# Altium schematic sheet MCU.SchDoc: MCU
size A4; DrawnBy: Nilesh Amarathunge; Revision: V1.0; SheetNumber: 1; SheetTotal: 4
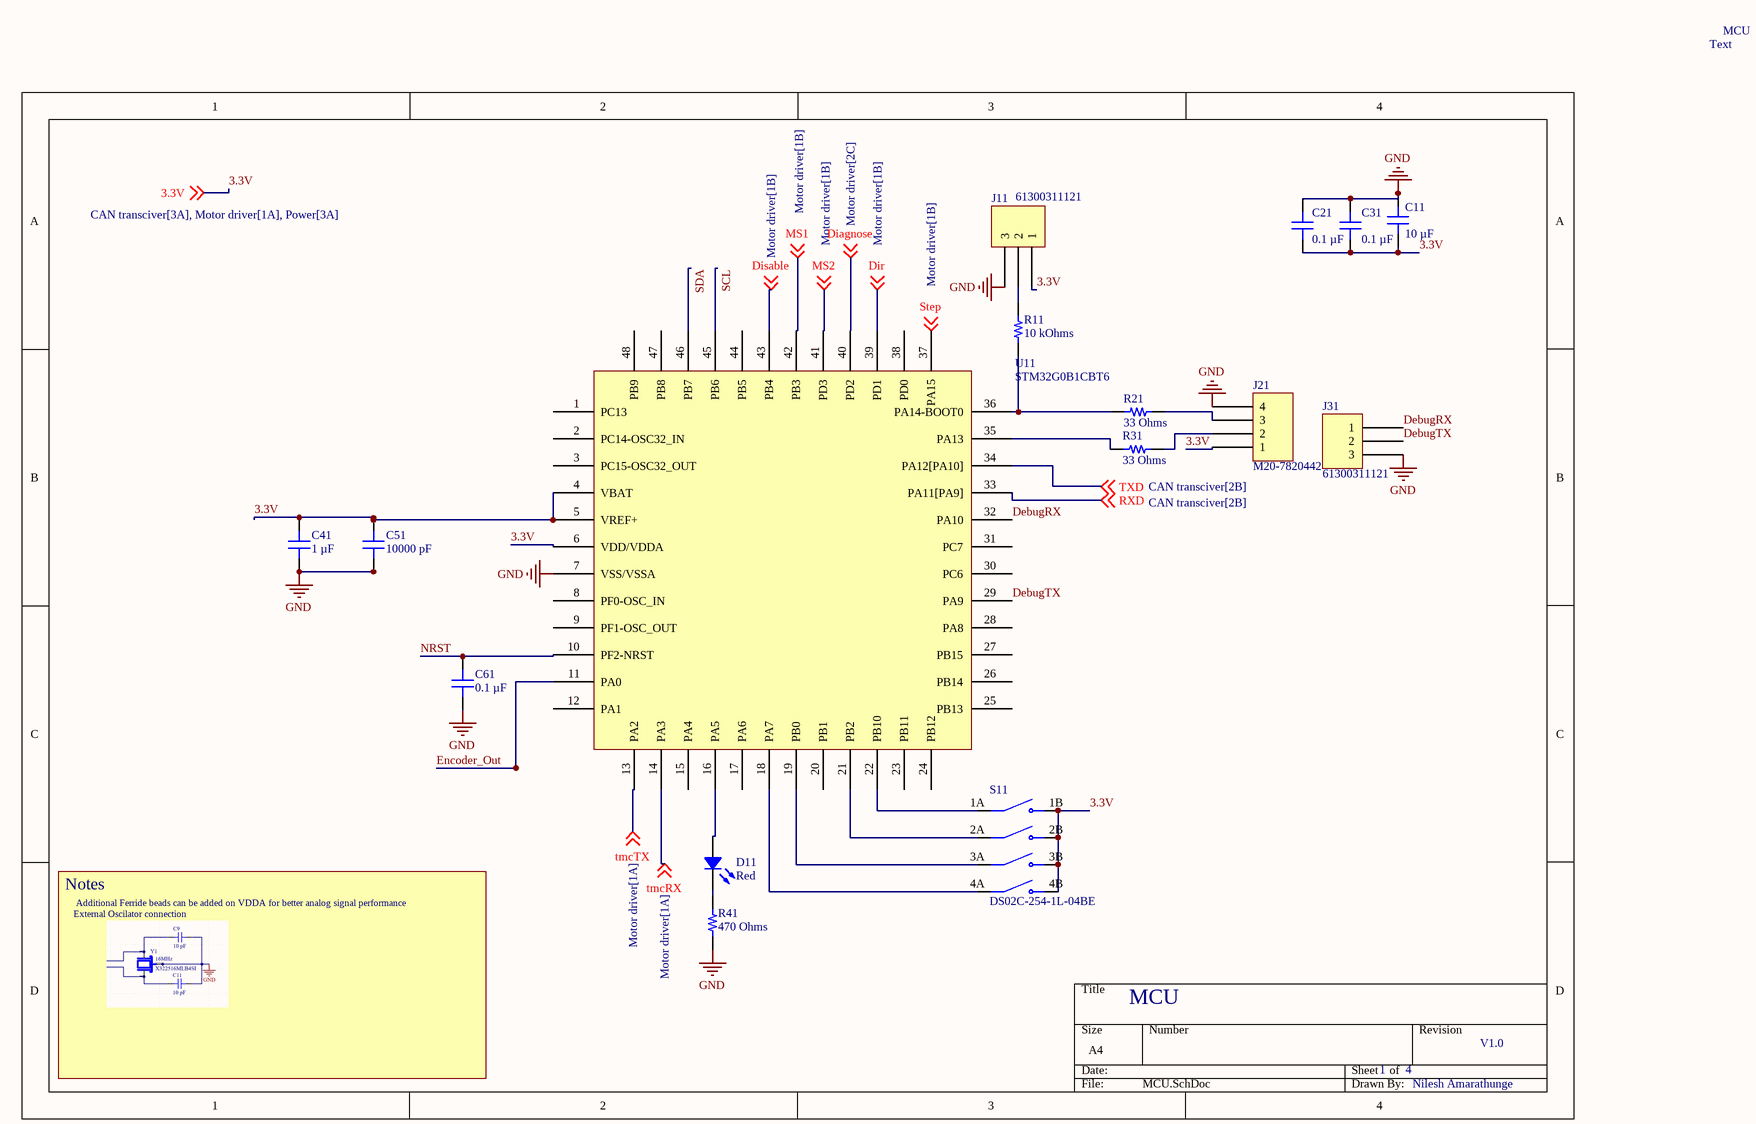
[diagram p0: MCU.SchDoc]

## Parts
C11  10 µF  [CAP 0805_2012]
C21  0.1 µF  [CAP 0805_2012]
C31  0.1 µF  [CAP 0805_2012]
C41  1 µF  [CAP 0805_2012]
C51  10000 pF  [CAP 0805_2012]
C61  0.1 µF  [CAP 0805_2012]
D11  Red  [LED 0805_2012 RED]
J11  61300311121  [WURTH WE-PHD 61300311121]
J21  M20-7820442  [HARWIN M20-7820445]
J31  61300311121  [WURTH WE-PHD 61300311121]
R11  10 kOhms  [YAGEO RES 0805_2012]
R21  33 Ohms  [RES 0805_2012]
R31  33 Ohms  [RES 0805_2012]
R41  470 Ohms  [RES 0805_2012]
S11  DS02C-254-1L-04BE  [SW_DS02C-254-1L-04BE]
U11  STM32G0B1CBT6  [QFP50P900X900X160-48N]

## Nets
GND: C11.2 C21.2 C31.2 C41.2 C51.2 C61.2 J11.3 J21.4 J31.3 R41.1 U11.7(VSS/VSSA)
3.3V: C11.1 C21.1 C31.1 C41.1 C51.1 J11.1 J21.1 S11.1B(NO1) S11.2B(NO2) S11.3B(NO3) S11.4B(NO4) U11.4(VBAT) U11.5(VREF+) U11.6(VDD/VDDA) ; off-sheet 3.3V
DebugRX: J31.1 U11.32(PA10)
DebugTX: J31.2 U11.29(PA9)
Diagnose: U11.40(PD2) ; off-sheet Diagnose
Dir: U11.39(PD1) ; off-sheet Dir
Disable: U11.43(PB4) ; off-sheet Disable
Encoder_Out: U11.11(PA0)
MS1: U11.42(PB3) ; off-sheet MS1
MS2: U11.41(PD3) ; off-sheet MS2
NRST: C61.1 U11.10(PF2-NRST)
RXD: U11.33(PA11[PA9]) ; off-sheet RXD
SCL: U11.45(PB6)
SDA: U11.46(PB7)
Step: U11.37(PA15) ; off-sheet Step
tmcRX: U11.14(PA3) ; off-sheet tmcRX
tmcTX: U11.13(PA2) ; off-sheet tmcTX
TXD: U11.34(PA12[PA10]) ; off-sheet TXD
NetD11_1: D11.1 U11.16(PA5)
NetD11_2: D11.2 R41.2
NetJ11_2: J11.2 R11.1
NetJ21_2: J21.2 R31.2
NetJ21_3: J21.3 R21.2
NetR11_2: R11.2 R21.1 U11.36(PA14-BOOT0)
NetR31_1: R31.1 U11.35(PA13)
NetS11_1A: S11.1A(COM1) U11.22(PB10)
NetS11_2A: S11.2A(COM2) U11.21(PB2)
NetS11_3A: S11.3A(COM3) U11.19(PB0)
NetS11_4A: S11.4A(COM4) U11.18(PA7)

Not connected (* = marked no-connect by the designer): U11 1(PC13) 2(PC14-OSC32_IN) 3(PC15-OSC32_OUT) 8(PF0-OSC_IN) 9(PF1-OSC_OUT) 12(PA1) 15(PA4) 17(PA6) 20(PB1) 23(PB11) 24(PB12) 25(PB13) 26(PB14) 27(PB15) 28(PA8) 30(PC6) 31(PC7) 38(PD0) 44(PB5) 47(PB8) 48(PB9)

## Notes on the sheet
- Text
- Notes
- External Oscilator connection
- Additional Ferride beads can be added on VDDA for better analog signal performance

## Library data of the parts
C11 = CL21B106KPQNNNE: CAP CER 10UF 10V X7R 0805; manufacturer: Samsung Electro-Mechanics; Tolerance: ±10%; Part Number: CL21B106KPQNNNE; Capacitance: 10 µF; Applications: General Purpose; componentlink1description: Datasheet; componentlink1url: http://www.samsungsem.com/kr/support/product-search/mlcc/CL21B106KPQNNNE.jsp; componentlink2description: DigiKey Link; componentlink2url: https://www.digikey.com/en/products/detail/samsung-electro-mechanics/CL21B106KPQNNNE/3887422; Device Package: 0805 (2012 Metric); lastupdated: 2024-02-09 8:15:41 PM; Lifecycle Status: Active; Minimum Order: 1; Mounting Type: Surface Mount, MLCC; Operating Temperature: -55°C ~ 125°C; Package / Case: 0805 (2012 Metric); packaging: TapeAndReel; partid: 13130; Part Status: Active; price: 0.02; series: CL; Size / Dimension: 0.079" L x 0.049" W (2.00mm x 1.25mm); Supplier 1: DigiKey; Supplier Part Number 1: 1276-1764-1-ND; Temperature Coefficient: X7R; Thickness (Max): 0.055" (1.40mm); value: 10 µF; Voltage - Rated: 10V; LCSC part #: C32635; LCSC link: https://www.lcsc.com/product-detail/C32635.html
C21 C31 C61 = CC0805KRX7R9BB104: CAP CER 0.1UF 50V X7R 0805; manufacturer: Yageo; Tolerance: ±10%; Part Number: CC0805KRX7R9BB104; Capacitance: 0.1 µF; Applications: General Purpose; componentlink1description: Datasheet; componentlink1url: https://www.yageo.com/upload/media/product/productsearch/datasheet/mlcc/UPY-GPHC_X7R_6.3V-to-50V_18.pdf; componentlink2description: DigiKey Link; componentlink2url: https://www.digikey.com/en/products/detail/yageo/CC0805KRX7R9BB104/302874; Device Package: 0805 (2012 Metric); Features: High Voltage; lastupdated: 2024-02-09 8:15:42 PM; Lifecycle Status: Active; Minimum Order: 1; Mounting Type: Surface Mount, MLCC; Operating Temperature: -55°C ~ 125°C; Package / Case: 0805 (2012 Metric); packaging: TapeAndReel; partid: 12715; Part Status: Active; price: 0.01; series: CC; Size / Dimension: 0.079" L x 0.049" W (2.00mm x 1.25mm); Supplier 1: DigiKey; Supplier Part Number 1: 311-1140-1-ND; Temperature Coefficient: X7R; Thickness (Max): 0.033" (0.85mm); value: 0.1 µF; Voltage - Rated: 50V; LCSC part #: C49678; LCSC link: https://www.lcsc.com/product-detail/C49678.html
C41 = CL21B105KOFNNNE: CAP CER 1UF 16V X7R 0805; manufacturer: Samsung Electro-Mechanics; Tolerance: ±10%; Part Number: CL21B105KOFNNNE; Capacitance: 1 µF; Applications: General Purpose; componentlink1description: Datasheet; componentlink1url: http://www.samsungsem.com/kr/support/product-search/mlcc/CL21B105KOFNNNE.jsp; componentlink2description: DigiKey Link; componentlink2url: https://www.digikey.com/en/products/detail/samsung-electro-mechanics/CL21B105KOFNNNE/3886684; Device Package: 0805 (2012 Metric); lastupdated: 2024-02-09 8:15:36 PM; Lifecycle Status: Active; Minimum Order: 1; Mounting Type: Surface Mount, MLCC; Operating Temperature: -55°C ~ 125°C; Package / Case: 0805 (2012 Metric); packaging: TapeAndReel; partid: 14424; Part Status: Active; price: 0.01; series: CL; Size / Dimension: 0.079" L x 0.049" W (2.00mm x 1.25mm); Supplier 1: DigiKey; Supplier Part Number 1: 1276-1026-1-ND; Temperature Coefficient: X7R; Thickness (Max): 0.053" (1.35mm); value: 1 µF; Voltage - Rated: 16V; LCSC part #: C24123; LCSC link: https://www.lcsc.com/product-detail/C24123.html
C51 = CL21B103KBANNNC: CAP CER 10000PF 50V X7R 0805; manufacturer: Samsung Electro-Mechanics; Tolerance: ±10%; Part Number: CL21B103KBANNNC; Capacitance: 10000 pF; Applications: General Purpose; componentlink1description: Datasheet; componentlink1url: http://www.samsungsem.com/kr/support/product-search/mlcc/CL21B103KBANNNC.jsp; componentlink2description: DigiKey Link; componentlink2url: https://www.digikey.com/en/products/detail/samsung-electro-mechanics/CL21B103KBANNNC/3886673; Device Package: 0805 (2012 Metric); lastupdated: 2024-02-09 8:15:59 PM; Lifecycle Status: Active; Minimum Order: 1; Mounting Type: Surface Mount, MLCC; Operating Temperature: -55°C ~ 125°C; Package / Case: 0805 (2012 Metric); packaging: TapeAndReel; partid: 6199; Part Status: Active; price: 0.01; series: CL; Size / Dimension: 0.079" L x 0.049" W (2.00mm x 1.25mm); Supplier 1: DigiKey; Supplier Part Number 1: 1276-1015-1-ND; Temperature Coefficient: X7R; Thickness (Max): 0.030" (0.75mm); value: 10000 pF; Voltage - Rated: 50V; LCSC part #: C1710; LCSC link: https://www.lcsc.com/product-detail/C1710.html
D11 = 5990110007F: LED RED 0805 SMD; Manufacturer: Dialight; Configuration: Standard; Current - Test: 20mA; Lens Color: 0.80mm; Lens Size: 1.40mm x 1.25mm; Lens Style: Rectangle with Flat Top; Millicandela Rating: 29mcd; Viewing Angle: 140°; Voltage - Forward (Vf) (Typ): 2.1V; Wavelength - Dominant: 633nm; Part Number: 5990110007F; Color: Red; ComponentLink1Description: Datasheet; ComponentLink1URL: http://www.dialightsignalsandcomponents.com/Assets/Brochures_And_Catalogs/Indication/CBI_SMD_new/Dialight_CBI_data_599-0805_Apr2018.pdf; ComponentLink2Description: DigiKey Link; ComponentLink2URL: https://www.digikey.com/en/products/detail/dialight/5990110007F/9385408; Device Package: 0805 (2012 Metric); Height (Max): 0.80mm; LastUpdated: 2024-06-03 8:00:07 PM; Lifecycle Status: Active; Minimum Order: 1; Mounting Type: Surface Mount; Package / Case: 0805 (2012 Metric); Packaging: TapeAndReel; PartId: 308; Part Status: Active; Price: 0.04; Series: 599; Size / Dimension: 2.00mm L x 1.25mm W; Supplier 1: DigiKey; Supplier Part Number 1: 350-4353-1-ND; Supplier Device Package: 0805; Value: Red; LCSC part #: C84260
J11 J31 = 61300311121: CONN HEADER VERT 3POS 2.54MM; Manufacturer: Würth Elektronik; Contact Length - Mating: 0.236" (6.00mm); Contact Length - Post: 0.118" (3.00mm); Current Rating (Amps): 3A; Material Flammability Rating: UL94 V-0; Number of Positions: 3; Number of Positions Loaded: All; Overall Contact Length: 0.454" (11.54mm); Pitch - Mating: 0.100" (2.54mm); Row Spacing - Mating: -40°C ~ 105°C; Shrouding: Unshrouded; Style: Board to Board or Cable; Part Number: 61300311121; ComponentLink1Description: Datasheet; ComponentLink1URL: https://katalog.we-online.de/em/datasheet/6130xx11121.pdf; ComponentLink2Description: DigiKey Link; ComponentLink2URL: https://www.digikey.com/en/products/detail/würth-elektronik/61300311121/4846825; Connector Type: Header; Contact Finish - Mating: Gold; Contact Material: Copper Alloy; Contact Shape: Square; Contact Type: Male Pin; Fastening Type: Push-Pull; Insulation Color: Black; Insulation Height: 0.100" (2.54mm); Insulation Material: Polyamide (PA6T), Nylon 6T; LastUpdated: 2024-10-18 1:43:15 PM; Lifecycle Status: Active; Minimum Order: 1; Mounting Type: Through Hole; Number of Rows: 1; Operating Temperature: -40°C ~ 105°C; Packaging: Bulk; PartId: 189; Part Status: Active; Price: 0.07; Series: WR-PHD; Supplier 1: DigiKey; Supplier Part Number 1: 732-5316-ND; Termination: Solder
J21 = M20-7820442: CONN RCPT 4POS 0.1 GOLD PCB; Manufacturer: Harwin Inc.; Connector Type: Receptacle; Contact Length - Post: 0.118" (3.00mm); Current Rating (Amps): 3A; Mated Stacking Heights: 11.04mm, 12.63mm; Material Flammability Rating: UL94 V-0; Number of Positions: 4; Number of Positions Loaded: All; Pitch - Mating: 0.100" (2.54mm); Style: Board to Board or Cable; Part Number: M20-7820442; ComponentLink1Description: Datasheet; ComponentLink1URL: https://cdn.harwin.com/pdfs/Harwin_PC_Connectors_M20.pdf; ComponentLink2Description: DigiKey Link; ComponentLink2URL: https://www.digikey.com/en/products/detail/harwin-inc/M20-7820442/3727760; Contact Finish - Mating: Gold; Contact Finish - Post: Tin; Contact Finish Thickness - Mating: Flash; Contact Type: Female Socket; Fastening Type: Push-Pull; Insulation Color: Black; Insulation Height: 0.335" (8.51mm); LastUpdated: 2022-09-21 6:57:11 PM; Lifecycle Status: Active; Minimum Order: 1; Mounting Type: Through Hole; Number of Rows: 1; Operating Temperature: -40°C ~ 105°C; Packaging: Tube; Part Status: Active; Price: 0.45; Series: M20; Supplier 1: DigiKey; Supplier Part Number 1: 952-1791-ND; Termination: Solder
R11 = RC0805FR-0710KL: RES 10K OHM 1% 1/8W 0805; Manufacturer: Yageo; Power (Watts): 0.125W, 1/8W; Temperature Coefficient: ±100ppm/°C; Part Number: RC0805FR-0710KL; Value: 10 kOhms; ComponentLink1Description: Datasheet; ComponentLink1URL: https://www.yageo.com/upload/media/product/productsearch/datasheet/rchip/PYu-RC_Group_51_RoHS_L_10.pdf; ComponentLink2Description: DigiKey Link; ComponentLink2URL: https://www.digikey.com/en/products/detail/yageo/RC0805FR-0710KL/727535; Composition: Thick Film; Device Package: 0805 (2012 Metric); Features: Moisture Resistant; Height - Seated (Max): 0.024" (0.60mm); LastUpdated: 2024-07-25 9:20:18 AM; Lifecycle Status: Active; Minimum Order: 1; Number of Terminations: 2; Operating Temperature: -55°C ~ 155°C; Package / Case: 0805 (2012 Metric); Packaging: TapeAndReel; PartId: 46046; Part Status: Active; Price: 0.01; Resistance: 10 kOhms; Series: RC_L; Size / Dimension: 0.079" L x 0.049" W (2.00mm x 1.25mm); Supplier 1: DigiKey; Supplier Part Number 1: 311-10.0KCRCT-ND; Supplier Device Package: 0805; Tolerance: ±1%; LCSC part #: C84376; ComponentLink3Description: LCSC link; ComponentLink3URL: https://www.lcsc.com/product-detail/C84376.html?s_z=n_RC0805FR-0710KL%2520
R21 R31 = SR0805FR-4733RL: RES 33 OHM 1% 1/2W 0805; Manufacturer: Yageo; Power (Watts): 0.5W, 1/2W; Temperature Coefficient: ±100ppm/°C; Part Number: SR0805FR-4733RL; Value: 33 Ohms; ComponentLink1Description: Datasheet; ComponentLink1URL: https://www.yageo.com/upload/media/product/app/datasheet/rchip/pyu-sr_20105_rohs_l.pdf; ComponentLink2Description: DigiKey Link; ComponentLink2URL: https://www.digikey.com/en/products/detail/yageo/SR0805FR-4733RL/17026888; Composition: Thick Film; Device Package: 0805 (2012 Metric); Features: Automotive AEC-Q200, Pulse Withstanding; Height - Seated (Max): 0.024" (0.60mm); LastUpdated: 2026-04-06 8:09:11 PM; Lifecycle Status: Active; Minimum Order: 1; Number of Terminations: 2; Operating Temperature: -55°C ~ 155°C; Package / Case: 0805 (2012 Metric); Packaging: TapeAndReel; PartId: 87401; Price: 0.16; Ratings: AEC-Q200; Resistance: 33 Ohms; Series: SR; Size / Dimension: 0.079" L x 0.049" W (2.00mm x 1.25mm); Supplier 1: DigiKey; Supplier Part Number 1: 13-SR0805FR-4733RLCT-ND; Supplier Device Package: 0805; Tolerance: ±1%; LCSC part #: C6234260
R41 = ERJ-PB6B4700V: RES SMD 470 OHM 0.1% 1/4W 0805; Manufacturer: Panasonic Electronic Components; Power (Watts): 0.25W, 1/4W; Temperature Coefficient: ±50ppm/°C; Part Number: ERJ-PB6B4700V; Value: 470 Ohms; ComponentLink1Description: Datasheet; ComponentLink1URL: https://industrial.panasonic.com/cdbs/www-data/pdf/RDM0000/AOA0000C328.pdf; ComponentLink2Description: DigiKey Link; ComponentLink2URL: https://www.digikey.com/en/products/detail/panasonic-electronic-components/ERJ-PB6B4700V/6213339; Composition: Thick Film; Device Package: 0805 (2012 Metric); Features: Automotive AEC-Q200; Height - Seated (Max): 0.028" (0.70mm); LastUpdated: 2026-04-05 8:11:23 PM; Lifecycle Status: Active; Minimum Order: 1; Number of Terminations: 2; Operating Temperature: -55°C ~ 155°C; Package / Case: 0805 (2012 Metric); Packaging: TapeAndReel; PartId: 28402; Part Status: Active; Price: 0.04; Ratings: AEC-Q200; Resistance: 470 Ohms; Series: ERJ-PB6; Size / Dimension: 0.079" L x 0.049" W (2.00mm x 1.25mm); Supplier 1: DigiKey; Supplier Part Number 1: P20556CT-ND; Supplier Device Package: 0805; Tolerance: ±0.1%; LCSC part #: C441978
S11 = DS02C-254-1L-04BE: 4 Position, Through Hole, 2.54 mm Pitch, Raised Piano Slide Actuator, Convex Bottom, Long Pin, DIP Switch; MF: Same Sky; SnapEDA_Link: https://www.snapeda.com/parts/DS02C-254-1L-04BE/Same+Sky/view-part/?ref=snap; Package: None; Value: *; MP: DS02C-254-1L-04BE; Check_prices: https://www.snapeda.com/parts/DS02C-254-1L-04BE/Same+Sky/view-part/?ref=eda; LCSC part #: C5123702
U11 = STM32G0B1CBT6: LCSC part #: C2847904